# Altium schematic sheet logic_000.SchDoc: Logic control
size A3; SheetNumber: 4; SheetTotal: 4
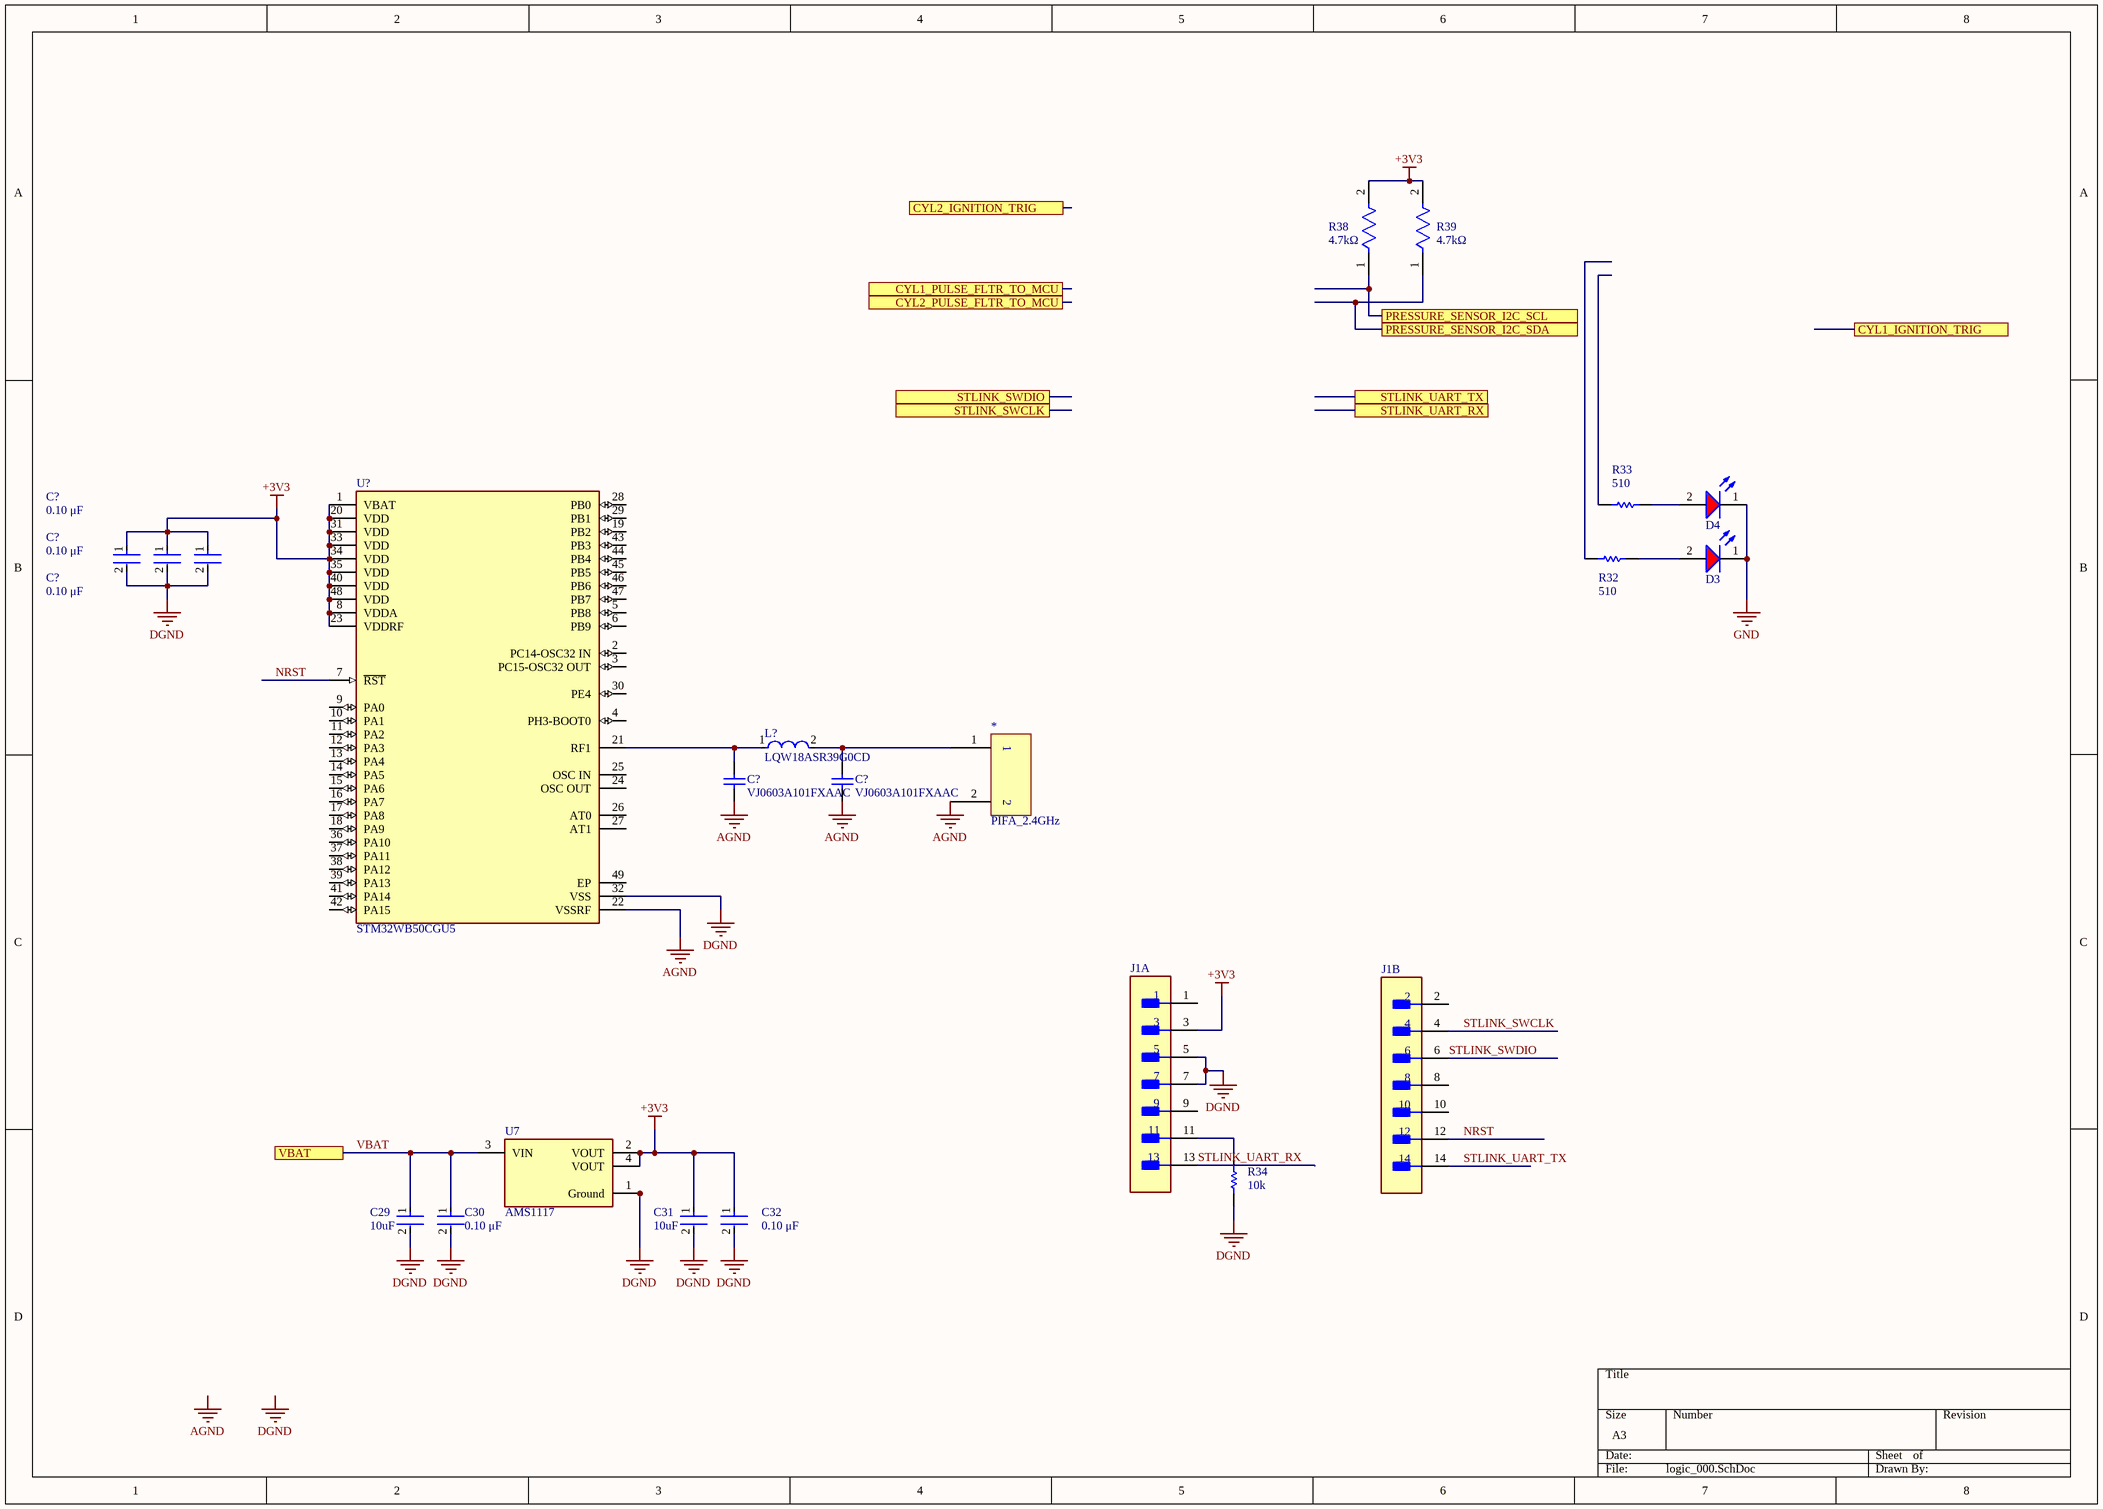
[diagram p0: logic_000.SchDoc]

## Parts
(Parts that share a designator on the sheet are numbered #1, #2 ... from top to bottom, then left to right.)
*  PIFA_2.4GHz
C29  Capacitance: 10uF  [FP-CL05A106MP5NUNC-MFG]  (hidden comment: CL05A106MP5NUNC)
C30  Capacitance: 0.10 μF  [FP-C0402-BB-MFG]  (hidden comment: C0402C104K8PACTU)
C31  Capacitance: 10uF  [FP-CL05A106MP5NUNC-MFG]  (hidden comment: CL05A106MP5NUNC)
C32  Capacitance: 0.10 μF  [FP-C0402-BB-MFG]  (hidden comment: C0402C104K8PACTU)
C?#1  value 0.10 μF  [FP-C0402-BB-MFG]  (hidden comment: C0402C104K8PACTU)
C?#2  value 0.10 μF  [FP-C0402-BB-MFG]  (hidden comment: C0402C104K8PACTU)
C?#3  value 0.10 μF  [FP-C0402-BB-MFG]  (hidden comment: C0402C104K8PACTU)
C?#4  VJ0603A101FXAAC  [CAPC1608X92X38LL15T08]
C?#5  VJ0603A101FXAAC  [CAPC1608X92X38LL15T08]
D3  150080SS75000  [WL-SMCW_0805_150080xx75000]  (value not drawn)
D4  150080SS75000  [WL-SMCW_0805_150080xx75000]  (value not drawn)
J1  FTSH-107-01-L-DV-K  [FP-FTSH-107-01-L-DV-K-MFG]  (value not drawn)  (parts A,B of 2)
L?  LQW18ASR39G0CD  [FP-LQW18AS_0C-MFG]
R32  value 510  [RESC1005X40X25LL05T10]  (hidden comment: RC0402FR-07510RL)
R33  value 510  [RESC1005X40X25LL05T10]  (hidden comment: RC0402FR-07510RL)
R34  value 10k  [RESC1005X40X25LL05T10]  (hidden comment: RC0402FR-0710KL)
R38  Resistance: 4.7kΩ  [FP-RC0402-0_4-MFG]  (hidden comment: RC0402JR-074K7L)
R39  Resistance: 4.7kΩ  [FP-RC0402-0_4-MFG]  (hidden comment: RC0402JR-074K7L)
U7  Package: AMS1117  [FP-AMS1117-IPC_C]  (hidden comment: AMS1117-3.3)
U?  STM32WB50CGU5  [FP-UFQFPN48-A0B9-MFG]

## Ports
CYL1_IGNITION_TRIG (see power_side[4B]), CYL1_PULSE_FLTR_TO_MCU (see input_filter[6A]), CYL2_IGNITION_TRIG (see power_side[4B]), CYL2_PULSE_FLTR_TO_MCU (see input_filter[6B]), PRESSURE_SENSOR_I2C_SCL (see input_output[6B]), PRESSURE_SENSOR_I2C_SDA (see input_output[6B]), STLINK_SWCLK, STLINK_SWDIO, STLINK_UART_RX, STLINK_UART_TX, VBAT (see input_output[7A], power_side[2A], power_side[2C], power_side[5B])

## Nets
+3V3: C31.1 C32.1 C?#1.1 C?#2.1 C?#3.1 J1.3 R38.2 R39.2 U7.2(VOUT) U7.4(VOUT) U?.1(VBAT) U?.8(VDDA) U?.20(VDD) U?.23(VDDRF) U?.31(VDD) U?.33(VDD) U?.34(VDD) U?.35(VDD) U?.40(VDD) U?.48(VDD)
AGND: *.2 C?#4.1 C?#5.1 U?.22(VSSRF)
DGND: C29.2 C30.2 C31.2 C32.2 C?#1.2 C?#2.2 C?#3.2 J1.5 J1.7 R34.1 U7.1(Ground) U?.32(VSS)
GND: D3.1(K) D4.1(K)
NRST: J1.12 U?.7(~{RST})
PRESSURE_SENSOR_I2C_SCL: R38.1 ; port PRESSURE_SENSOR_I2C_SCL
PRESSURE_SENSOR_I2C_SDA: R39.1 ; port PRESSURE_SENSOR_I2C_SDA
STLINK_SWCLK: J1.4
STLINK_SWDIO: J1.6
STLINK_UART_RX: J1.13
STLINK_UART_TX: J1.14
VBAT: C29.1 C30.1 U7.3(VIN) ; port VBAT
Net*_1: *.1 C?#5.2 L?.2
NetC?#4_2: C?#4.2 L?.1 U?.21(RF1)
NetD3_2: D3.2(A) R32.1
NetD4_2: D4.2(A) R33.1
NetJ1_11: J1.11 R34.2

Not connected (* = marked no-connect by the designer): J1 1 2 8 9 10; R32 2; R33 2; U? 2(PC14-OSC32_IN) 3(PC15-OSC32_OUT) 4(PH3-BOOT0) 5(PB8) 6(PB9) 9(PA0) 10(PA1) 11(PA2) 12(PA3) 13(PA4) 14(PA5) 15(PA6) 16(PA7) 17(PA8) 18(PA9) 19(PB2) 24(OSC_OUT) 25(OSC_IN) 26(AT0) 27(AT1) 28(PB0) 29(PB1) 30(PE4) 36(PA10) 37(PA11) 38(PA12) 39(PA13) 41(PA14) 42(PA15) 43(PB3) 44(PB4) 45(PB5) 46(PB6) 47(PB7) 49(EP)

## Notes on the sheet
- Labels drawn without touching a wire or pin: AGND, DGND

## Library data of the parts
C29 C31 = CMP-13271-000002-1: CAP CER 10UF 10V X5R 0402; Manufacturer: Samsung; Temperature Coefficient: 15%; Tolerance: 20%; Material: Ceramic; Octopart: https://octopart.com/cl05a106mp5nunc-samsung-22457395; Voltage Rating: 10V; RoHS: TRUE; Value: 10uF; Height: 0.7mm; Digikey Description: CAP CER 10UF 10V X5R 0402; Automotive: No; Package: CL05A106MP5NUNC; Device Class L1: Passive Components; Temperature Range High: +85°C; ComponentLink2Description: Datasheet; Device Class L2: Capacitors; Temperature Characteristic: X5R; Manufacturer Part Number: CL05A106MP5NUNC; Temperature: -55°C to +85°C; ComponentLink2URL: http://www.samsungsem.com/kr/support/product-search/mlcc/__icsFiles/afieldfile/2019/05/10/19-CL05A106MP5NUNC.pdf; Device Class L3: Ceramic Capacitors; Category: Cap; Temperature Range Low: -55°C; Ipc Land Pattern Name: CAPC10050X50; Lead Free: Yes
C30 C32 = CMP-2008-02046-2: CAP CER 0.1UF 10V X5R 0402; Manufacturer: Kemet; Material: Ceramic; Temperature Coefficient: 15%; Tolerance: 0.1; Value: 0.10 μF; Package: C0402-BB; Temperature: -55°C to +125°C; ComponentLink2Description: Datasheet; Temperature Characteristic: X5R; Device Class L1: Passive Components; Height: 0.55mm; Lead Free: Yes; ComponentLink2URL: https://content.kemet.com/datasheets/KEM_C1002_X7R_SMD.pdf; Device Class L2: Capacitors; Temperature Range Low: -55°C; Temperature Range High: +125°C; RoHS: TRUE; Octopart: https://octopart.com/c0402c104k8pactu-kemet-140039; Automotive: No; Mouser Description: Capacitor 100 nF 10 VDC 0402; Category: Cap; Voltage Rating: 10 V; Digikey Description: CAP CER 0.1UF 10V X5R 0402; Ipc Land Pattern Name: CAPC10050X50; Device Class L3: Ceramic Capacitors; Manufacturer Part Number: C0402C104K8PACTU
C?#1-C?#3 = CMP-2008-02046-2: CAP CER 0.1UF 10V X5R 0402; Manufacturer: Kemet; Material: Ceramic; Temperature Coefficient: 15%; Tolerance: 0.1; Package: C0402-BB; Temperature: -55°C to +125°C; ComponentLink2Description: Datasheet; Capacitance: 0.10 μF; Temperature Characteristic: X5R; Device Class L1: Passive Components; Height: 0.55mm; Lead Free: Yes; ComponentLink2URL: https://content.kemet.com/datasheets/KEM_C1002_X7R_SMD.pdf; Device Class L2: Capacitors; Temperature Range Low: -55°C; Temperature Range High: +125°C; RoHS: TRUE; Octopart: https://octopart.com/c0402c104k8pactu-kemet-140039; Automotive: No; Mouser Description: Capacitor 100 nF 10 VDC 0402; Category: Cap; Voltage Rating: 10 V; Digikey Description: CAP CER 0.1UF 10V X5R 0402; Ipc Land Pattern Name: CAPC10050X50; Device Class L3: Ceramic Capacitors; Manufacturer Part Number: C0402C104K8PACTU
C?#4 C?#5 = CMP-2006-01182-1: Manufacturer: Vitramon; Part Number: VJ0603A101FXAAC
D3 D4 = CMP-1426-00010-4: Led, Red, 630 Nm, 1.9 V, 30 Ma, 60 Mcd Rohs Compliant: Yes; Reverse Voltage: 5V; Test Current: 20mA; Forward Current: 100mA; Power Dissipation: 72mW; Peak Wavelength: 645nm; Lens Style: Clear, Rectangular; Viewing Angle: 140°; Forward Voltage: 1.9V; Luminous Intensity: 60mcd; Wavelength: 630nm; Max Junction Temperature (Tj): 95°C; Color: Red; Case/Package: 0805; Length: 2mm; RoHS: Compliant; Max Operating Temperature: 85°C; Min Operating Temperature: -40°C; Case Code (Metric): 2012; Case Code (Imperial): 0805; Dominant Wavelength: 630nm; Max Reverse Voltage (DC): 5V; REACH SVHC: Unknown; Packaging: Tape and Reel; Mount: Surface Mount; Width: 1.25mm; Height: 700µm
J1 = CMP-02766-001412-1: CONN HEADER SMD 14POS 1.27MM; Number of Contacts: 14; Gender: Male; Termination: Solder; Lead Free: Lead Free; Depth: 5.84mm; Min Operating Temperature: -55°C; Length: 8.89mm; RoHS Compliant: Yes; Housing Material: Polymer; Housing Color: Black; Max Operating Temperature: 125°C; Number of Rows: 2; Pitch: 1.27mm; Radiation Hardening: No; Orientation: Straight; Packaging: Rail/Tube; Contact Material: Bronze; Contact Plating: Gold
L? = CMP-06042-006464-1: Wire Wound RF Inductor 390nH ±2% 100mA 4.35Ω 0603 (1608)
R32 R33 = CMP-2002-07727-1: Manufacturer: Yageo / Phycomp; Part Number: RC0402FR-07510RL
R34 = CMP-2002-07353-1: Manufacturer: Yageo / Phycomp; Part Number: RC0402FR-0710KL
R38 R39 = CMP-2002-08011-2: Tolerance: 5%; Power Rating: 63mW; Voltage Rating: 50V; Temperature Coefficient: 100ppm/°C; Composition: Thick Film; Max Operating Temperature: 155°C; Case/Package: 0402; Depth: 500µm; Packaging: Tape & Reel; Number of Pins: 2; Schedule B: 8533210045, 8533210045; Case Code (Imperial): 0402; Termination: SMD/SMT; Military Standard: Not; Lead Free: Lead Free; Width: 500µm; REACH SVHC: No SVHC; Max Power Dissipation: 63mW; Voltage Rating (AC): 50V; Features: Moisture Resistant; Min Operating Temperature: -55°C; Number of Terminations: 2; RoHS: Compliant; Height: 350µm; Voltage Rating (DC): 50V; Length: 1mm
U7 = CMP-209535-000001-1: LDO Voltage Regulators 1A, 3.3V; Manufacturer: Advanced Monolithic Systems; Dropout Voltage: 1.1V; Output Type: Fixed; Nominal Supply Current: 5mA; Max Power Dissipation: 1.2W; Max Supply Voltage: 15V; Number Of Outputs: 1; Standoff Height: 0.64mm; Max Junction Temp: +125°C; Height: 1.8mm; Device Class L2: Power Management ICs; ComponentLink2Description: Datasheet; ComponentLink2URL: http://www.advanced-monolithic.com/pdf/ds1117.pdf; Category: IC; RoHS: TRUE; Automotive: No; Device Class L1: Integrated Circuits (ICs); Output Current: 1A; Device Class L3: Voltage Regulators - Linear; Temperature: -40°C to +125°C; Output Voltage: 3.3V; Manufacturer Part Number: AMS1117-3.3; Temperature Range Low: -40°C; Octopart: https://octopart.com/ams1117-3.3-advanced+monolithic+systems-25899300; Lead Free: Yes; Ipc Land Pattern Name: SOT229P700X180-4; Temperature Range High: +125°C
U? = CMP-12105-000070-1.A.2: ULTRA-LOW-POWER DUAL CORE ARM CO; Manufacturer: STMicroelectronics; Core Architecture: ARM Cortex-M4; Max Supply Voltage: 3.6V; Ram Size: 128KBytes; Number Of Timers/Counters: 7; Number Of Adc Channels: 10; Number Of Uart Channels: 1; Min Supply Voltage: 2V; Max Junction Temp: +105°C; Number Of Cores: 2; Standoff Height: 0mm; Interface: I2C,SPI,UART,USART,SMBus,Other; Memory Size: 1MBytes; Number Of I/Os: 30; Memory Type: FLASH; Frequency: 64MHz; Data Bus Width: 32bits; ComponentLink2URL: https://www.st.com/resource/en/datasheet/stm32wb50cg.pdf; Temperature Range High: +105°C; Package: UFQFPN48-A0B9; Automotive: No; Ambient Temperature Range High: +85°C; Octopart: https://octopart.com/stm32wb50cgu5-stmicroelectronics-106131324; Device Class L2: Embedded Processors and Controllers; Category: IC; Manufacturer Part Number: STM32WB50CGU5; Height: 0.65mm; Number Of A/D Converters: 1; Temperature: -10°C to +105°C; Lead Free: Yes; Number Of Spi Channels: 1; Device Class L3: Microcontrollers; Temperature Range Low: -10°C; RoHS: TRUE; Ambient Temperature Range Low: -10°C; Digikey Description: ULTRA-LOW-POWER DUAL CORE ARM CO; Number Of I2C Channels: 1; Device Class L1: Integrated Circuits (ICs); ComponentLink2Description: Datasheet